# EasyEDA schematic SCH_UM982-and-F9P-adapter_2025-07-17.json
TITLE: Sheet_1; REV: 1.0; Date: 2024-04-28; Sheet: 1/1; Drawn By: Ferenc Vági (Fecó); Company: Your Company
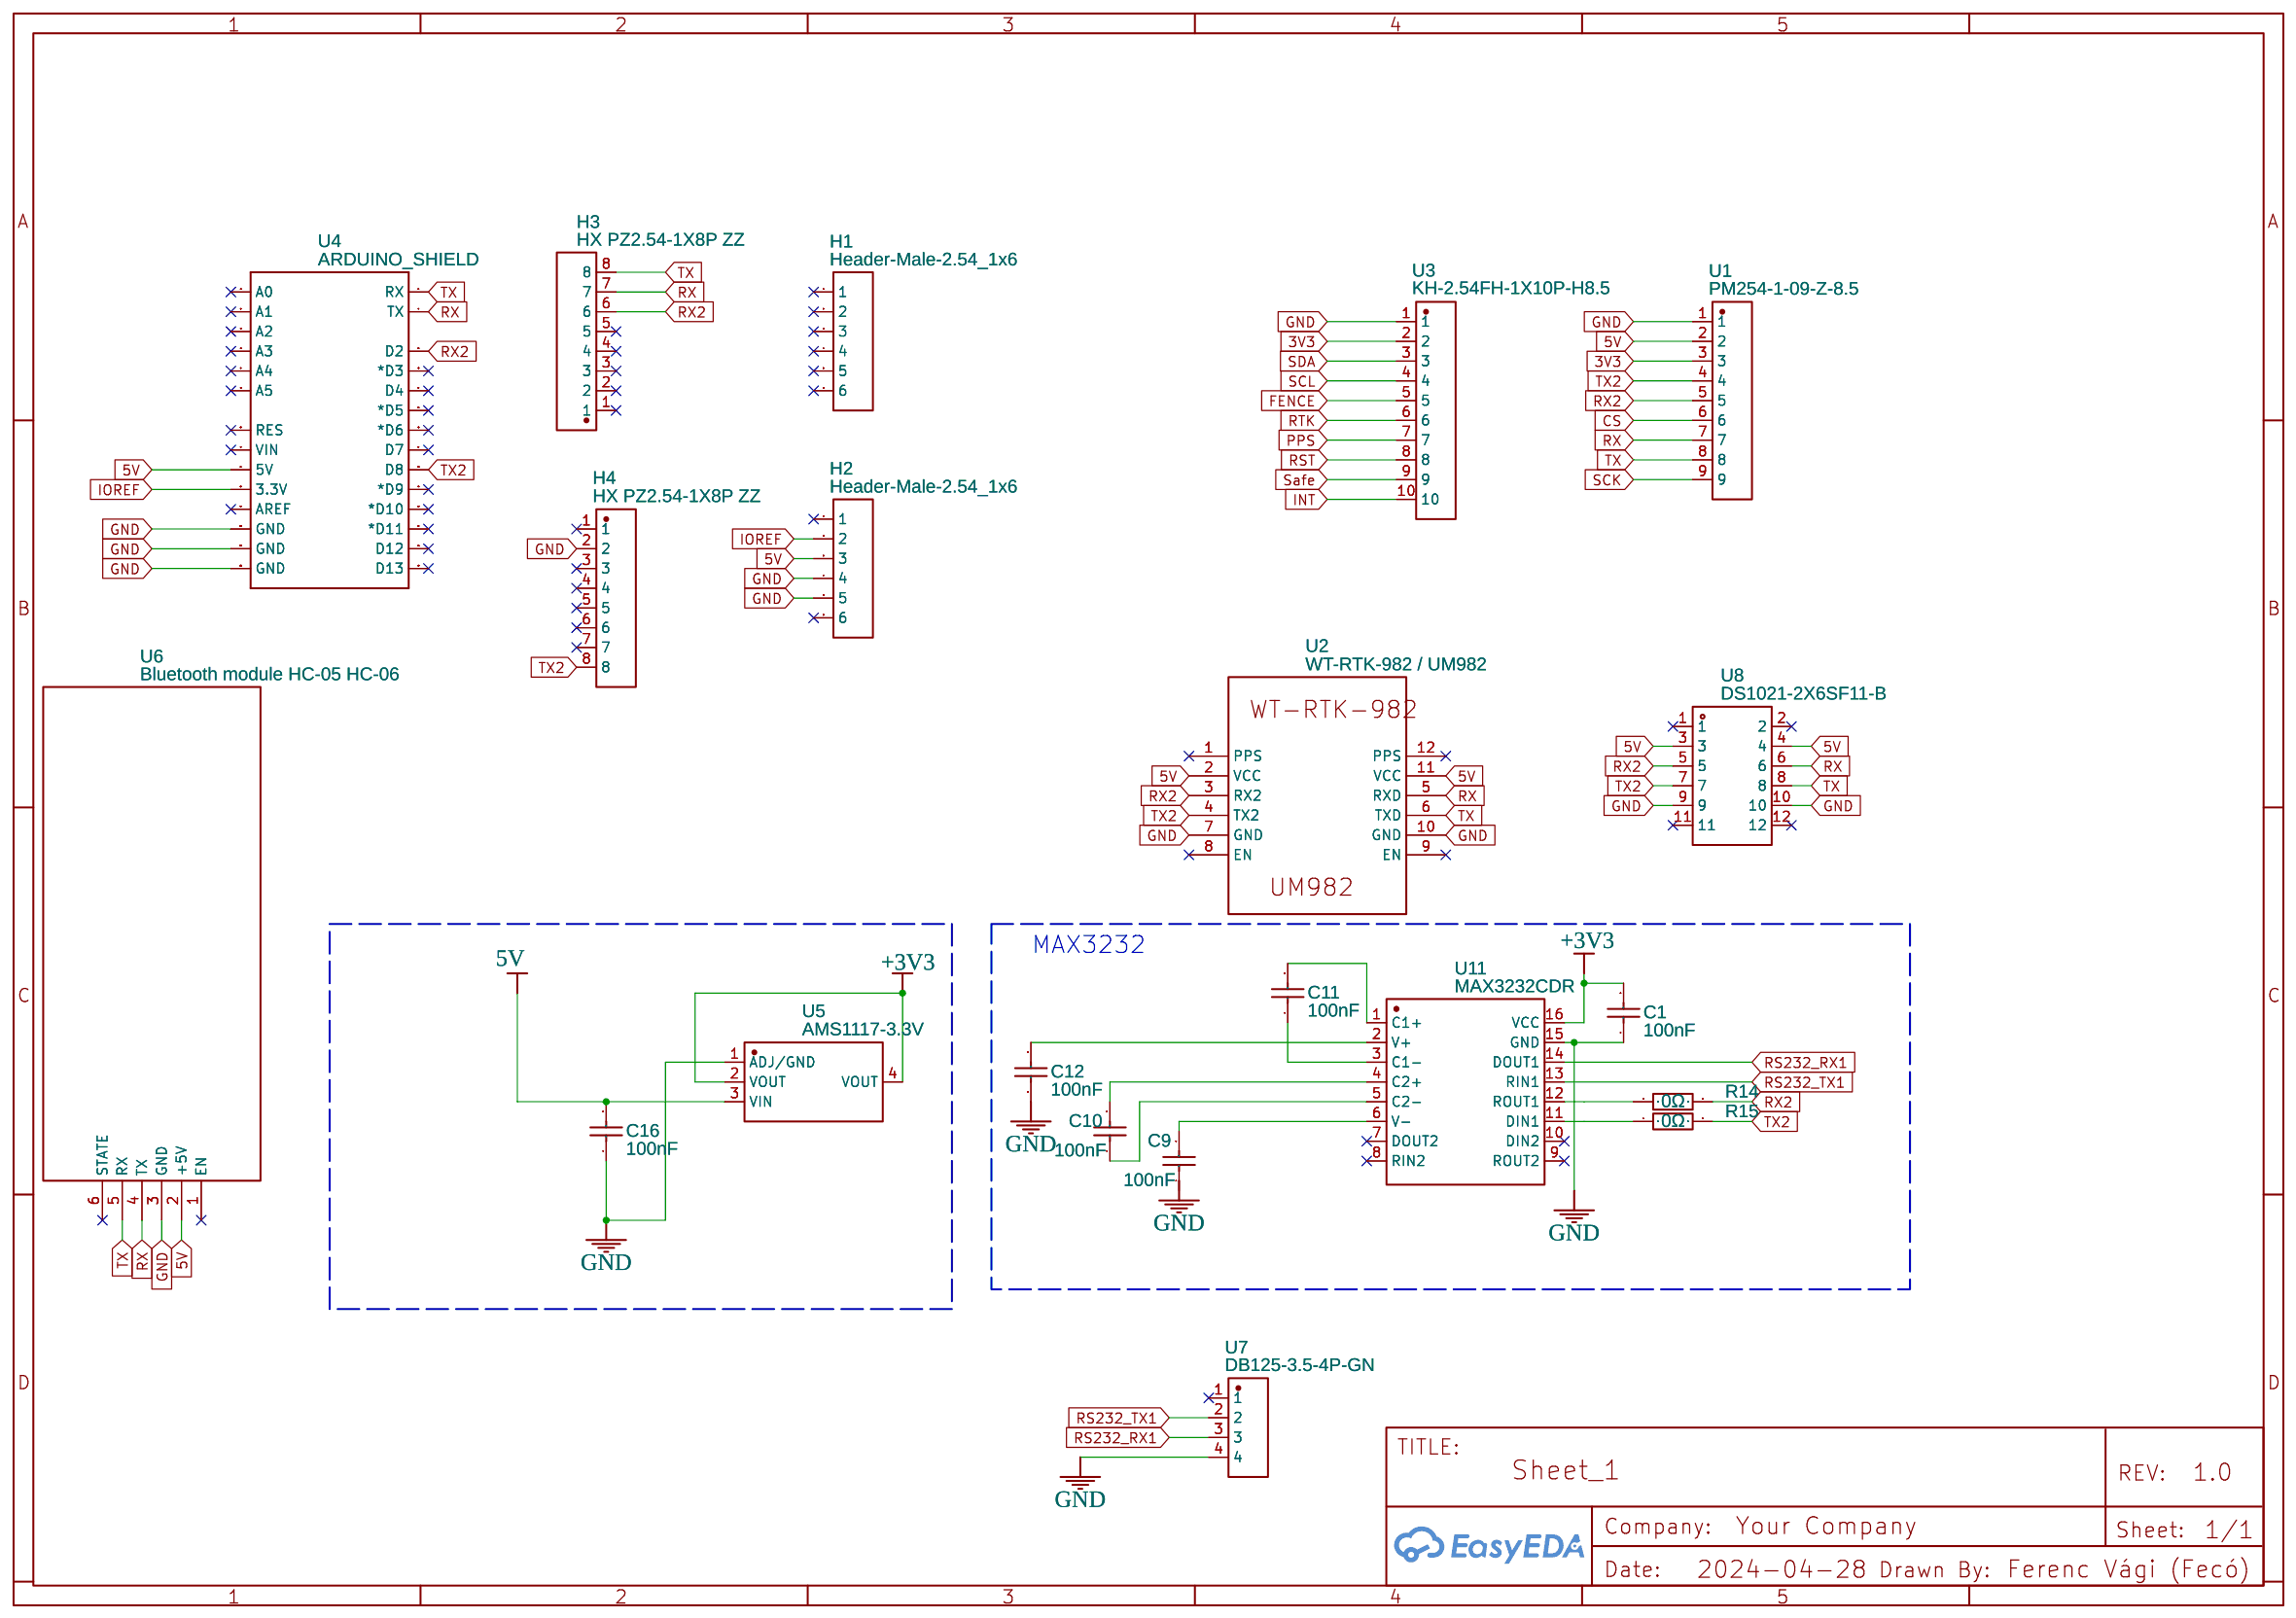
[diagram p0: schematic sheet]

## Parts
C1  100nF  [C1206]
C9  100nF  [C1206]
C10  100nF  [C1206]
C11  100nF  [C1206]
C12  100nF  [C1206]
C16  100nF  [C1206]
H1  Header-Male-2.54_1x6  [HDR-TH_6P-P2.54-V-M-1]
H2  Header-Male-2.54_1x6  [HDR-TH_6P-P2.54-V-M-1]
H3  HX PZ2.54-1X8P ZZ  [HDR-TH_8P-P2.54-V-M]
H4  HX PZ2.54-1X8P ZZ  [HDR-TH_8P-P2.54-V-M]
R14  0Ω  [R0805]
R15  0Ω  [R0805]
U1  PM254-1-09-Z-8.5  [HDR-TH_9P-P2.54-V-F]
U2  WT-RTK-982 / UM982  [WT-RTK-982 UM982]
U3  KH-2.54FH-1X10P-H8.5  [HDR-TH_10P-P2.54-V-F]
U4  ARDUINO_SHIELD  [DUEMILANOVE_SHIELD_LONGPADS]
U5  AMS1117-3.3V  [SOT-223-4_L6.5-W3.5-P2.30-LS7.0-BR]
U6  Bluetooth module HC-05 HC-06  [HC-05]
U7  DB125-3.5-4P-GN  [CONN-TH_DB125-3.5-4P-GN]
U8  DS1021-2X6SF11-B  [HDR-TH_12P-P2.54-V-M-R2-C6-S2.54]
U11  MAX3232CDR  [NSOP-16_L9.9-W3.9-P1.27-LS6.0-BL]

## Library data of the parts
C1 C9-C12 C16 = CL31B104KBCNNNC: Supplier: LCSC; Manufacturer: SAMSUNG(三星); Supplier Part: C24497; JLCPCB Part Class: Basic Part
H1 H2 = Header-Male-2.54_1x6: Supplier: LCSC; Manufacturer: BOOMELE(博穆精密); Manufacturer Part: 2.54-1x6P直针; Supplier Part: C37208; JLCPCB Part Class: Extended Part
H3 H4 = HX PZ2.54-1X8P ZZ: Supplier: LCSC; Supplier Part: C32713274; Manufacturer: hanxia(韩下); Manufacturer Part: HX PZ2.54-1x8P ZZ; JLCPCB Part Class: Extended Part; Contributor: lcsc
R14 R15 = 0805W8F0000T5E: Supplier: LCSC; Manufacturer: UNI-ROYAL(厚声); Supplier Part: C17477; JLCPCB Part Class: Basic Part
U1 = PM254-1-09-Z-8.5: Contributor: LCSC; Supplier: LCSC; Supplier Part: C2897372; Manufacturer: HCTL(华灿天禄); JLCPCB Part Class: Extended Part
U2 = WT-RTK-982 / UM982: Manufacturer: WitMotion; Manufacturer Part: WT-RTK-982; Supplier: WitMotion; Supplier Part: WT-RTK-982; link: https://witmotion-sensor.com/products/witmotion-gps-rtk-module-um982-high-precision-centimeter-level-differential-relative-positioning-and-orientation-um960; Contributor: gunicsba
U3 = KH-2.54FH-1X10P-H8.5: Contributor: LCSC; Supplier: LCSC; Supplier Part: C2905418; Manufacturer: kinghelm(金航标); JLCPCB Part Class: Extended Part
U4 = ARDUINO_SHIELD: Contributor: SparkFun
U5 = AMS1117-3.3V: Contributor: LCSC; Supplier: LCSC; Supplier Part: C2688239; Manufacturer: WPMtek(维攀); JLCPCB Part Class: Extended Part
U6 = Bluetooth module HC-05 HC-06: Manufacturer Part: HC05; Contributor: Sutee.S
U7 = DB125-3.5-4P-GN: Contributor: LCSC; Supplier: LCSC; Supplier Part: C2757925; Manufacturer: DORABO(地博电气); Manufacturer Part: DB125-3.5-4P-GN-S; JLCPCB Part Class: Extended Part
U8 = DS1021-2X6SF11-B: Supplier: LCSC; Supplier Part: C7430402; Manufacturer: CONNFLY; Manufacturer Part: DS1021-2x6SF11-B; JLCPCB Part Class: Extended Part; Contributor: lcsc
U11 = MAX3232CDR: Supplier: LCSC; Manufacturer: TI(德州仪器); Supplier Part: C45843; JLCPCB Part Class: Extended Part

## Nets
3V3: U1.3 U3.2
5V: C16.2 H2.3 U1.2 U2.2(VCC) U2.11(VCC) U4.5V U5.3(VIN) U6.2(+5V) U8.3 U8.4
+3V3: C1.2 U5.2(VOUT) U5.4(VOUT) U11.16(VCC)
GND: C1.1 C9.1 C12.1 C16.1 H2.4 H2.5 H4.2 U1.1 U2.7(GND) U2.10(GND) U3.1 U4.GND@0(GND) U4.GND@1(GND) U4.GND@2(GND) U5.1(ADJ/GND) U6.3(GND) U7.4 U8.9 U8.10 U11.15(GND)
CS: U1.6
FENCE: U3.5
INT: U3.10
IOREF: H2.2 U4.3.3V
PPS: U3.7
RS232_RX1: U7.3 U11.14(DOUT1)
RS232_TX1: U7.2 U11.13(RIN1)
RST: U3.8
RTK: U3.6
RX: H3.7 U1.7 U2.5(RXD) U4.TX U6.4(TX) U8.6
RX2: H3.6 R14.2 U1.5 U2.3(RX2) U4.D2 U8.5
Safe: U3.9
SCK: U1.9
SCL: U3.4
SDA: U3.3
TX: H3.8 U1.8 U2.6(TXD) U4.RX U6.5(RX) U8.8
TX2: H4.8 R15.2 U1.4 U2.4(TX2) U4.D8 U8.7
Net-(C9-2): C9.2 U11.6(V-)
Net-(C10-1): C10.1 U11.5(C2-)
Net-(C10-2): C10.2 U11.4(C2+)
Net-(C11-1): C11.1 U11.3(C1-)
Net-(C11-2): C11.2 U11.1(C1+)
Net-(C12-2): C12.2 U11.2(V+)
Net-(R14-1): R14.1 U11.12(ROUT1)
Net-(R15-1): R15.1 U11.11(DIN1)

Not connected (* = marked no-connect by the designer): H1 1* 2* 3* 4* 5* 6*; H2 1* 6*; H3 1* 2* 3* 4* 5*; H4 1* 3* 4* 5* 6* 7*; U2 1(PPS)* 8(EN)* 9(EN)* 12(PPS)*; U4 A0* A1* A2* A3* A4* A5* AREF* D3(*D3)* D4* D5(*D5)* D6(*D6)* D7* D9(*D9)* D10(*D10)* D11(*D11)* D12* D13* RES* VIN*; U6 1(EN)* 6(STATE)*; U7 1*; U8 1* 2* 11* 12*; U11 7(DOUT2)* 8(RIN2)* 9(ROUT2)* 10(DIN2)*

## Notes on the sheet
- MAX3232
